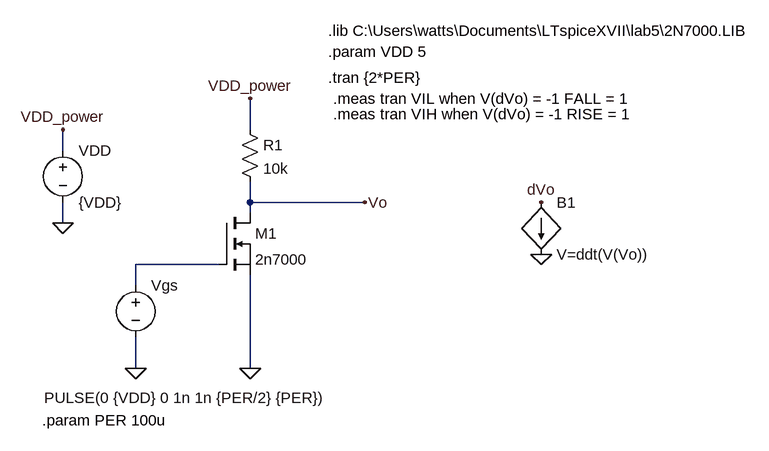
[diagram p0: schematic NMOS_2N700_time.asc]
NMOS_2N700_time.asc, the LTspice schematic file:
Version 4
SHEET 1 1096 680
WIRE 240 -16 240 -64
WIRE -48 16 -48 -16
WIRE 240 96 240 64
WIRE 416 96 240 96
WIRE 240 112 240 96
WIRE -48 128 -48 96
WIRE 192 192 64 192
WIRE 64 224 64 192
WIRE 64 352 64 304
WIRE 240 352 240 208
FLAG 64 352 0
FLAG 240 352 0
FLAG -48 128 0
FLAG 240 -64 VDD_power
FLAG -48 -16 VDD_power
FLAG 688 176 0
FLAG 416 96 Vo
FLAG 688 96 dVo
SYMBOL nmos 192 112 R0
SYMATTR InstName M1
SYMATTR Value 2n7000
SYMATTR Prefix X
SYMBOL voltage 64 208 R0
WINDOW 3 -141 189 Left 2
WINDOW 123 0 0 Left 0
WINDOW 39 0 0 Left 0
SYMATTR InstName Vgs
SYMATTR Value PULSE(0 {VDD} 0 1n 1n {PER/2} {PER})
SYMBOL voltage -48 0 R0
WINDOW 123 0 0 Left 0
WINDOW 39 0 0 Left 0
SYMATTR InstName VDD
SYMATTR Value {VDD}
SYMBOL res 224 -32 R0
SYMATTR InstName R1
SYMATTR Value 10k
SYMBOL bi 688 96 R0
SYMATTR InstName B1
SYMATTR Value V=ddt(V(Vo))
TEXT 360 -168 Left 2 !.lib C:\\Users\\watts\\Documents\\LTspiceXVII\\lab5\\2N7000.LIB
TEXT 360 -136 Left 2 !.param VDD 5
TEXT 360 -96 Left 2 !.tran {2*PER}
TEXT 368 -64 Left 2 !.meas tran VIL when V(dVo) = -1 FALL = 1
TEXT 368 -40 Left 2 !.meas tran VIH when V(dVo) = -1 RISE = 1
TEXT -80 432 Left 2 !.param PER 100u

The netlist it stands for:
* NMOS_2N700_time.asc
XM1 Vo N001 0 2n7000  ; pins D G S
Vgs N001 0 PULSE(0 {VDD} 0 1n 1n {PER/2} {PER})
VDD VDD_power 0 {VDD}
R1 VDD_power Vo 10k
B1 dVo 0 V=ddt(V(Vo))
.lib C:\Users\watts\Documents\LTspiceXVII\lab5\2N7000.LIB
.param VDD 5
.tran {2*PER}
.meas tran VIL when V(dVo) = -1 FALL = 1
.meas tran VIH when V(dVo) = -1 RISE = 1
.param PER 100u
.backanno
.end